# Altium project ESP32 WITH FLASHER.PrjPcb
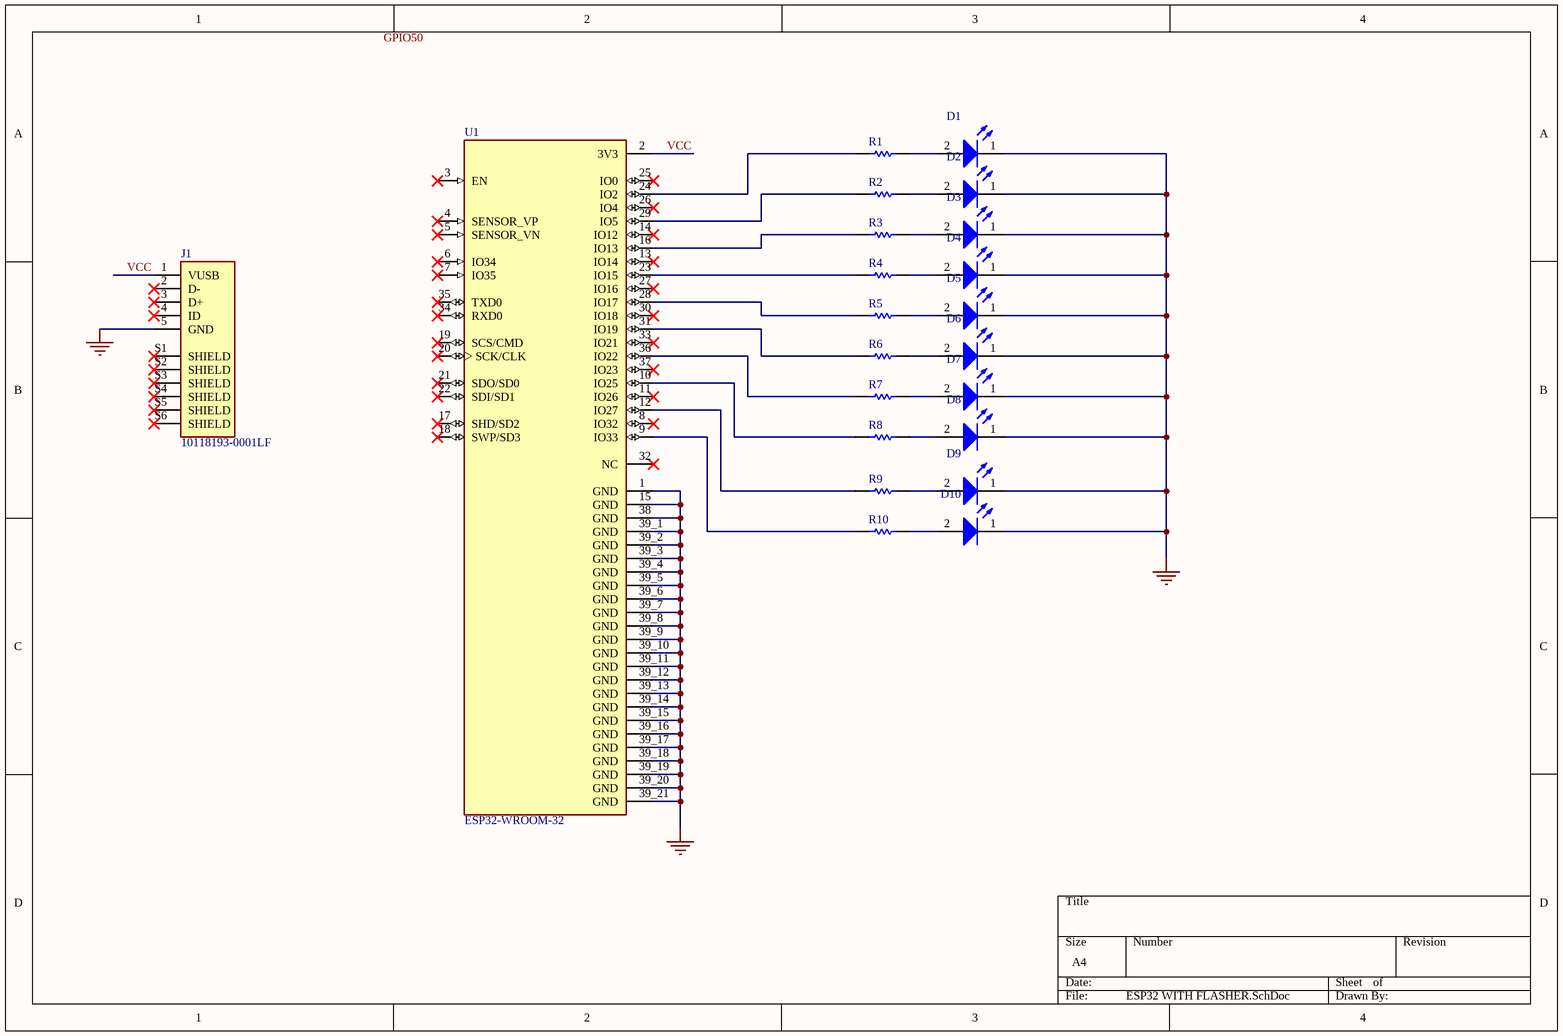
[diagram p0: ESP32 WITH FLASHER.SchDoc]
1 sheet, 22 parts. Net scope: global (net labels, ports and power ports of the same name join across sheets).
Board file: ESP32 WITH FLASHER.PcbDoc

## Sheet ESP32 WITH FLASHER.SchDoc
size A4; SheetNumber: 1; SheetTotal: 1

### Parts
D1  15400385A3590  [WL-TIRW_D3.9H5.3]  (value not drawn)
D2  15400385A3590  [WL-TIRW_D3.9H5.3]  (value not drawn)
D3  15400385A3590  [WL-TIRW_D3.9H5.3]  (value not drawn)
D4  15400385A3590  [WL-TIRW_D3.9H5.3]  (value not drawn)
D5  15400385A3590  [WL-TIRW_D3.9H5.3]  (value not drawn)
D6  15400385A3590  [WL-TIRW_D3.9H5.3]  (value not drawn)
D7  15400385A3590  [WL-TIRW_D3.9H5.3]  (value not drawn)
D8  15400385A3590  [WL-TIRW_D3.9H5.3]  (value not drawn)
D9  15400385A3590  [WL-TIRW_D3.9H5.3]  (value not drawn)
D10  15400385A3590  [WL-TIRW_D3.9H5.3]  (value not drawn)
J1  10118193-0001LF  [AMPHENOL_10118193-0001LF]
R1  ERJ-8GEY0R00V  [RESC3216X70X50NL05T20]  (value not drawn)
R2  ERJ-8GEY0R00V  [RESC3216X70X50NL05T20]  (value not drawn)
R3  ERJ-8GEY0R00V  [RESC3216X70X50NL05T20]  (value not drawn)
R4  ERJ-8GEY0R00V  [RESC3216X70X50NL05T20]  (value not drawn)
R5  ERJ-8GEY0R00V  [RESC3216X70X50NL05T20]  (value not drawn)
R6  ERJ-8GEY0R00V  [RESC3216X70X50NL05T20]  (value not drawn)
R7  ERJ-8GEY0R00V  [RESC3216X70X50NL05T20]  (value not drawn)
R8  ERJ-8GEY0R00V  [RESC3216X70X50NL05T20]  (value not drawn)
R9  ERJ-8GEY0R00V  [RESC3216X70X50NL05T20]  (value not drawn)
R10  ERJ-8GEY0R00V  [RESC3216X70X50NL05T20]  (value not drawn)
U1  ESP32-WROOM-32  [MODULE_ESP32-WROOM-32]

### Nets
GND: D1.1(K) D2.1(K) D3.1(K) D4.1(K) D5.1(K) D6.1(K) D7.1(K) D8.1(K) D9.1(K) D10.1(K) J1.5(GND) U1.1(GND) U1.15(GND) U1.38(GND) U1.39_1(GND) U1.39_2(GND) U1.39_3(GND) U1.39_4(GND) U1.39_5(GND) U1.39_6(GND) U1.39_7(GND) U1.39_8(GND) U1.39_9(GND) U1.39_10(GND) U1.39_11(GND) U1.39_12(GND) U1.39_13(GND) U1.39_14(GND) U1.39_15(GND) U1.39_16(GND) U1.39_17(GND) U1.39_18(GND) U1.39_19(GND) U1.39_20(GND) U1.39_21(GND)
VCC: J1.1(VUSB) U1.2(3V3)
NetD1_2: D1.2(A) R1.2
NetD2_2: D2.2(A) R2.2
NetD3_2: D3.2(A) R3.2
NetD4_2: D4.2(A) R4.2
NetD5_2: D5.2(A) R5.2
NetD6_2: D6.2(A) R6.2
NetD7_2: D7.2(A) R7.2
NetD8_2: D8.2(A) R8.2
NetD9_2: D9.2(A) R9.2
NetD10_2: D10.2(A) R10.2
NetR1_1: R1.1 U1.24(IO2)
NetR2_1: R2.1 U1.29(IO5)
NetR3_1: R3.1 U1.16(IO13)
NetR4_1: R4.1 U1.23(IO15)
NetR5_1: R5.1 U1.28(IO17)
NetR6_1: R6.1 U1.31(IO19)
NetR7_1: R7.1 U1.36(IO22)
NetR8_1: R8.1 U1.10(IO25)
NetR9_1: R9.1 U1.12(IO27)
NetR10_1: R10.1 U1.9(IO33)

Not connected (* = marked no-connect by the designer): J1 2(D-)* 3(D+)* 4(ID)* S1(SHIELD)* S2(SHIELD)* S3(SHIELD)* S4(SHIELD)* S5(SHIELD)* S6(SHIELD)*; U1 3(EN)* 4(SENSOR_VP)* 5(SENSOR_VN)* 6(IO34)* 7(IO35)* 8(IO32)* 11(IO26)* 13(IO14)* 14(IO12)* 17(SHD/SD2)* 18(SWP/SD3)* 19(SCS/CMD)* 20(SCK/CLK)* 21(SDO/SD0)* 22(SDI/SD1)* 25(IO0)* 26(IO4)* 27(IO16)* 30(IO18)* 32(NC)* 33(IO21)* 34(RXD0)* 35(TXD0)* 37(IO23)*

### Notes on the sheet
- Labels drawn without touching a wire or pin: GPIO50

### Library data of the parts
D1-D10 = CMP-03913-82270983-1: 15400385A3590 WL-TIRW THT Infrared Round Waterclear; Forward Voltage: 1.5V; Viewing Angle: 35°; Wavelength: 850nm; Max Reverse Voltage (DC): 5V; Forward Current: 1A; Packaging: Bulk; RoHS: Non-Compliant; Peak Wavelength: 850nm; NexarPartId: 82270983
J1 = 10118193-0001LF: Micro USB 2.0, Input Output Connectors, B TYPE RECEPTACLE; MF: Amphenol ICC; Value: *; MP: 10118193-0001LF; Package: None; Check_prices: https://www.snapeda.com/parts/10118193-0001LF/Amphenol+FCI/view-part/?ref=eda; Purchase-URL: https://pricing.snapeda.com/search/part/10118193-0001LF/?ref=eda; Price: None; Availability: In Stock; SnapEDA_Link: https://www.snapeda.com/parts/10118193-0001LF/Amphenol+FCI/view-part/?ref=snap
R1-R10 = CMP-2003-00541-1: Manufacturer: Panasonic; Part Number: ERJ-8GEY0R00V
U1 = ESP32-WROOM-32: Bluetooth, WiFi 802.11b/g/n, Bluetooth v4.2 +EDR, Class 1, 2 and 3 Transceiver Module 2.4GHz ~ 2.5GHz Antenna Not Included, U.FL Surface Mount; MF: Espressif Systems; Price: None; Availability: In Stock; MP: ESP32-WROOM-32; Package: Module Espressif Systems; SnapEDA_Link: https://www.snapeda.com/parts/ESP32-WROOM-32/Espressif+Systems/view-part/?ref=snap; Check_prices: https://www.snapeda.com/parts/ESP32-WROOM-32/Espressif+Systems/view-part/?ref=eda; Value: *; Purchase-URL: https://pricing.snapeda.com/search/part/ESP32-WROOM-32/?ref=eda